# Altium schematic sheet FLEX_MCU_CONFIG.SchDoc
size A2; PageSetup: Record=PageOptions|CenterHorizontal=True|CenterVertical=True|PrintScale=0.69|XCorrection=1.00|YCorrection=1.00|PrintKind=0|BorderSize=5000000|LeftOffset=0|BottomOffset=0|Orientation=2|PaperLength=1000|PaperWidth=1000|Scale=100|PaperSource=7|PrintQuality=-3|MediaType=1|DitherType=10|PrintScaleMode=1|PaperKind=Tabloid|PaperIndex=3
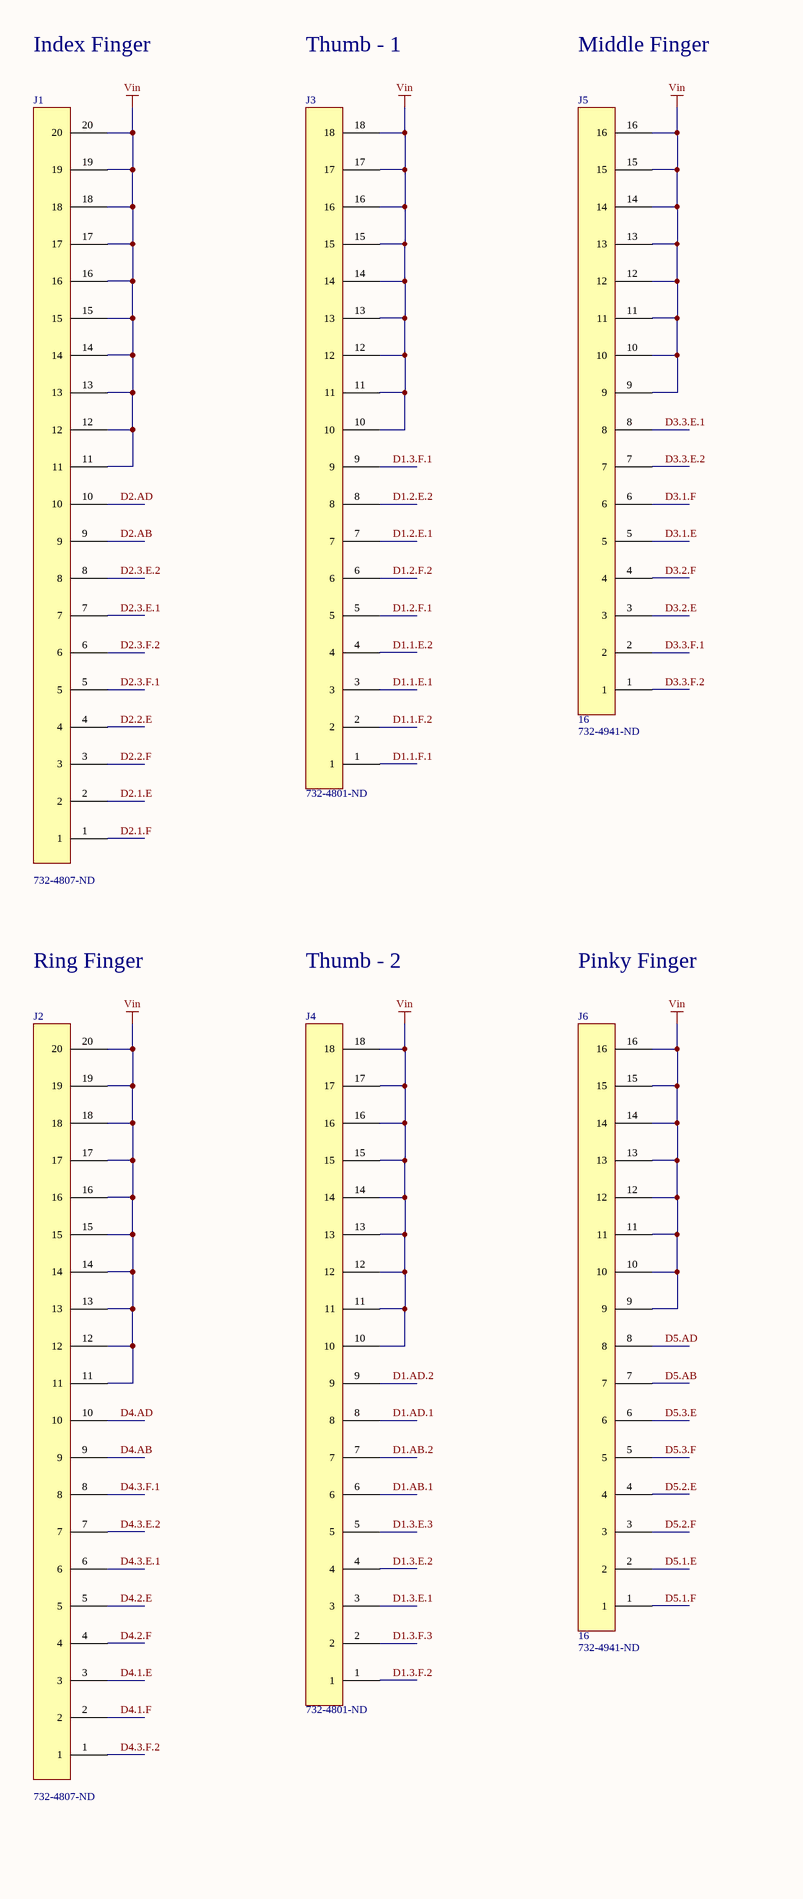
[diagram p0: FLEX_MCU_CONFIG.SchDoc, left]
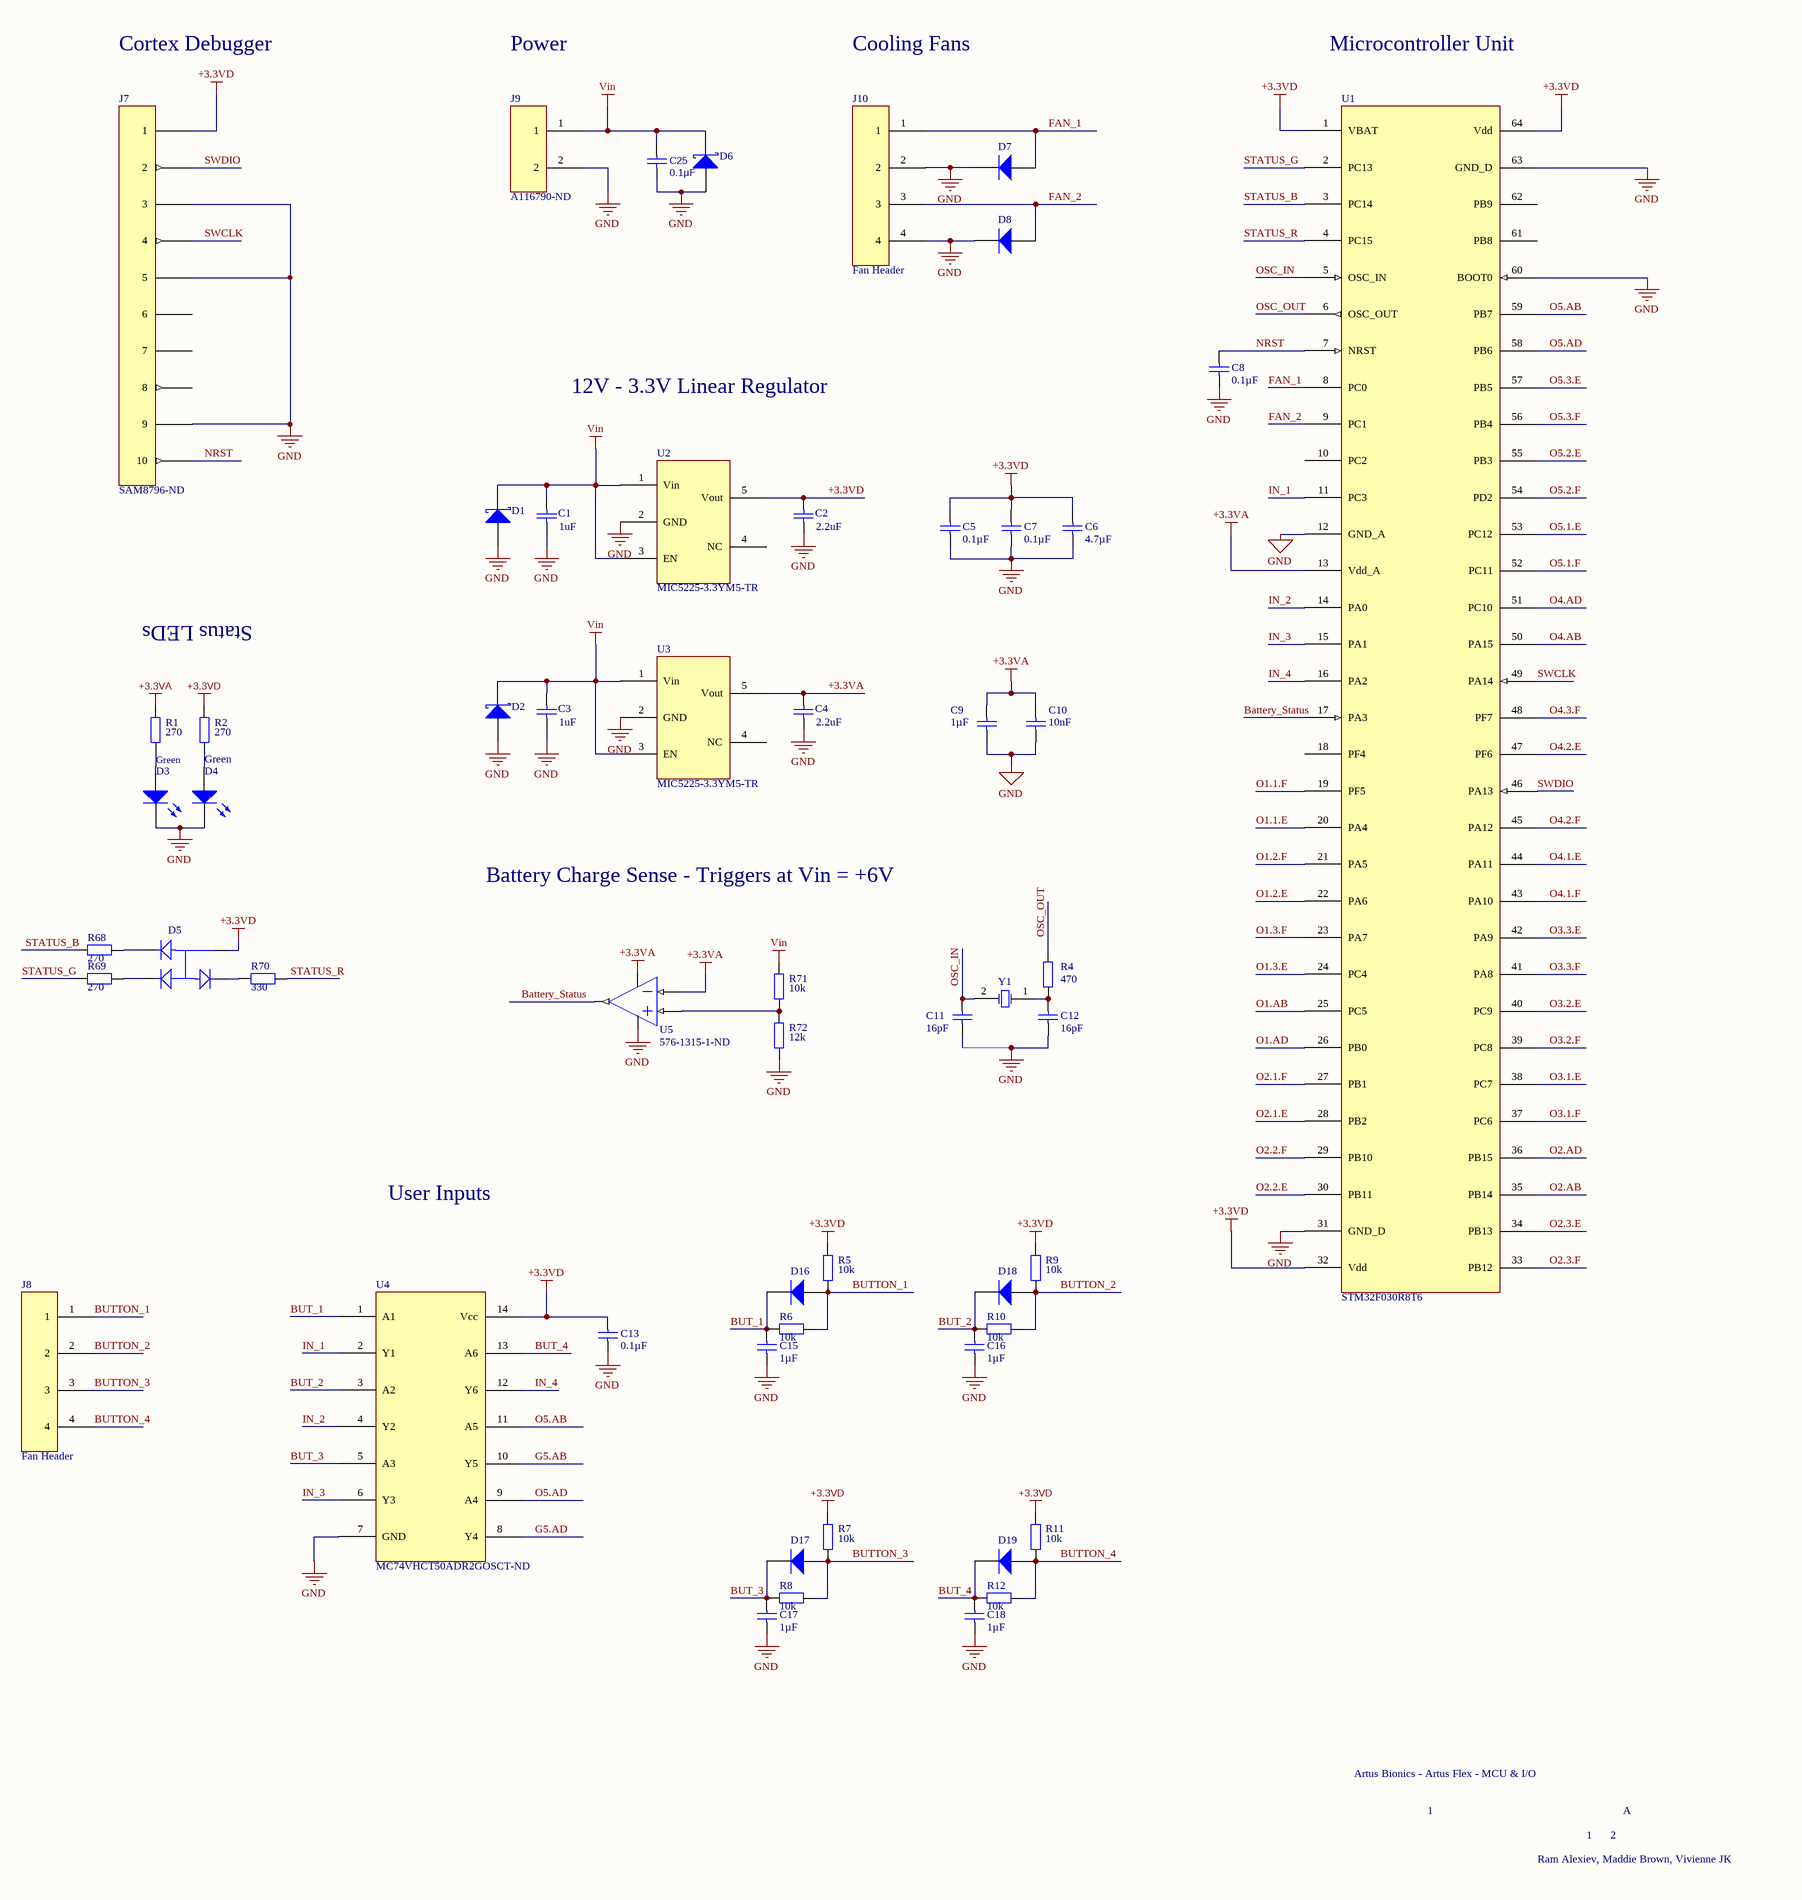
[diagram p1: FLEX_MCU_CONFIG.SchDoc, right]

## Parts
C1  value 1uF  [TDK C-Series (1608)]
C2  value 2.2uF  [TDK C-Series (1608)]
C3  value 1uF  [TDK C-Series (1608)]
C4  value 2.2uF  [TDK C-Series (1608)]
C5  value 0.1µF  [TDK C-Series (1608)]
C6  value 4.7µF  [TDK C-Series (1608)]  (hidden comment: Cap)
C7  value 0.1µF  [TDK C-Series (1608)]
C8  value 0.1µF  [TDK C-Series (1608)]
C9  value 1µF  [TDK C-Series (1608)]
C10  value 10nF  [TDK C-Series (1608)]
C11  value 16pF  [Johanson S-Series (1608)]
C12  value 16pF  [Johanson S-Series (1608)]
C13  value 0.1µF  [TDK C-Series (1608)]  (hidden comment: Cap)
C15  value 1µF  [TDK C-Series (1608)]  (hidden comment: Cap)
C16  value 1µF  [TDK C-Series (1608)]  (hidden comment: Cap)
C17  value 1µF  [TDK C-Series (1608)]  (hidden comment: Cap)
C18  value 1µF  [TDK C-Series (1608)]  (hidden comment: Cap)
C25  value 0.1µF  [TDK C-Series (1608)]
D1  (no value)  [Diode_TVS]
D2  (no value)  [Diode_TVS]
D3  LTST-C193KGKT-5A  [Lite-On LTST-C193K-Series (1608)]  (value not drawn)
D4  LTST-C193KGKT-5A  [Lite-On LTST-C193K-Series (1608)]  (value not drawn)
D5  Cree CLVBA-FKA-CAEDH8BBB7A363  [Cree CLVBA-FKA-Series (4-SOJ)]  (value not drawn)
D6  Diode BAT17  [Diode_TVS]  (value not drawn)
D7  Diode 1N4006  [Diode_Shottky]  (value not drawn)
D8  Diode 1N4006  [Diode_Shottky]  (value not drawn)
D16  de  [Diode_Shottky]  (value not drawn)
D17  de  [Diode_Shottky]  (value not drawn)
D18  de  [Diode_Shottky]  (value not drawn)
D19  de  [Diode_Shottky]  (value not drawn)
J1  Supplier Part Number 1: 732-4807-ND  [20PIN_UP_CONNECTOR]  (hidden comment: 20 Pin Header)
J2  Supplier Part Number 1: 732-4807-ND  [20PIN_UP_CONNECTOR]  (hidden comment: 20 Pin Header)
J3  Supplier Part Number 1: 732-4801-ND  [18PIN_UP_CONNECTOR]  (hidden comment: 18 Pin Header)
J4  Supplier Part Number 1: 732-4801-ND  [18PIN_UP_CONNECTOR]  (hidden comment: 18 Pin Header)
J5  16  Supplier Part Number 1: 732-4941-ND
J6  16  Supplier Part Number 1: 732-4941-ND
J7  Supplier Part Number 2: SAM8796-ND  [Samtec FTSH-105-01-L-DV-K]  (hidden comment: Cortex Debugger)
J8  Fan Header
J9  Supplier Part Number 1: A116790-ND  [2PIN_TERMINAL_BLOCK]  (hidden comment: Power Header)
J10  Fan Header
R1  value 270  [Panasonic ERJ-Series (1608)]
R2  value 270  [Panasonic ERJ-Series (1608)]
R4  value 470  [Panasonic ERJ-Series (1608)]
R5  value 10k  [Panasonic ERJ-Series (1608)]
R6  value 10k  [Panasonic ERJ-Series (1608)]
R7  value 10k  [Panasonic ERJ-Series (1608)]
R8  value 10k  [Panasonic ERJ-Series (1608)]
R9  value 10k  [Panasonic ERJ-Series (1608)]
R10  value 10k  [Panasonic ERJ-Series (1608)]
R11  value 10k  [Panasonic ERJ-Series (1608)]
R12  value 10k  [Panasonic ERJ-Series (1608)]
R68  value 270  [Panasonic ERJ-Series (1608)]
R69  value 270  [Panasonic ERJ-Series (1608)]
R70  value 330  [Panasonic ERJ-Series (1608)]
R71  value 10k  [Panasonic ERJ-Series (1608)]
R72  value 12k  [Panasonic ERJ-Series (1608)]
U1  STM32F030R8T6
U2  MIC5225-3.3YM5-TR  [LINEAR REGULATOR SOT95P280X145-5N]
U3  MIC5225-3.3YM5-TR  [LINEAR REGULATOR SOT95P280X145-5N]
U4  Supplier Part Number 1: MC74VHCT50ADR2GOSCT-ND  (hidden comment: MC74VHCT50A)
U5  Supplier Part Number 1: 576-1315-1-ND  [LINEAR REGULATOR SOT95P280X145-5N]  (hidden comment: TSV991ILT)
Y1  (no value)  [Abracon ABM3-8.000MHZ-D2Y-T (2-DFN)]

## Nets
+3.3VA: C4.2 C9.2 C10.2 R1.2 U1.13(Vdd_A) U3.5(Vout) U5.2(VCC-) U5.4(IN-)
+3.3VD: C2.2 C5.2 C6.2 C7.2 C13.2 D5.2(COMMON_ANODE) J7.1 R2.2 R5.1 R7.1 R9.1 R11.1 U1.1(VBAT) U1.32(Vdd) U1.64(Vdd) U2.5(Vout) U4.14(Vcc)
GND: C1.1 C2.1 C3.1 C4.1 C5.1 C6.1 C7.1 C8.1 C9.1 C10.1 C11.2 C12.2 C13.1 C15.1 C16.1 C17.1 C18.1 C25.1 D1.3(A) D2.3(A) D3.2(K) D4.2(K) D6.1(A) D7.2(K) D8.2(K) J7.3 J7.5 J7.9 J9.2 J10.2 J10.4 R72.2 U1.12(GND_A) U1.31(GND_D) U1.60(BOOT0) U1.63(GND_D) U2.2(GND) U3.2(GND) U4.7(GND) U5.5(VCC+)
Vin: C1.2 C3.2 C25.2 D1.1(K) D2.1(K) D6.3(K) J1.11 J1.12 J1.13 J1.14 J1.15 J1.16 J1.17 J1.18 J1.19 J1.20 J2.11 J2.12 J2.13 J2.14 J2.15 J2.16 J2.17 J2.18 J2.19 J2.20 J3.10 J3.11 J3.12 J3.13 J3.14 J3.15 J3.16 J3.17 J3.18 J4.10 J4.11 J4.12 J4.13 J4.14 J4.15 J4.16 J4.17 J4.18 J5.9 J5.10 J5.11 J5.12 J5.13 J5.14 J5.15 J5.16 J6.9 J6.10 J6.11 J6.12 J6.13 J6.14 J6.15 J6.16 J9.1 R71.1 U2.1(Vin) U2.3(EN) U3.1(Vin) U3.3(EN)
Battery_Status: U1.17(PA3) U5.1(OUT)
BUT_1: C15.2 D16.2(K) R6.1 U4.1(A1)
BUT_2: C16.2 D18.2(K) R10.1 U4.3(A2)
BUT_3: C17.2 D17.2(K) R8.1 U4.5(A3)
BUT_4: C18.2 D19.2(K) R12.1 U4.13(A6)
BUTTON_1: D16.1(A) J8.1 R5.2 R6.2
BUTTON_2: D18.1(A) J8.2 R9.2 R10.2
BUTTON_3: D17.1(A) J8.3 R7.2 R8.2
BUTTON_4: D19.1(A) J8.4 R11.2 R12.2
D1.1.E.1: J3.3
D1.1.E.2: J3.4
D1.1.F.1: J3.1
D1.1.F.2: J3.2
D1.2.E.1: J3.7
D1.2.E.2: J3.8
D1.2.F.1: J3.5
D1.2.F.2: J3.6
D1.3.E.1: J4.3
D1.3.E.2: J4.4
D1.3.E.3: J4.5
D1.3.F.1: J3.9
D1.3.F.2: J4.1
D1.3.F.3: J4.2
D1.AB.1: J4.6
D1.AB.2: J4.7
D1.AD.1: J4.8
D1.AD.2: J4.9
D2.1.E: J1.2
D2.1.F: J1.1
D2.2.E: J1.4
D2.2.F: J1.3
D2.3.E.1: J1.7
D2.3.E.2: J1.8
D2.3.F.1: J1.5
D2.3.F.2: J1.6
D2.AB: J1.9
D2.AD: J1.10
D3.1.E: J5.5
D3.1.F: J5.6
D3.2.E: J5.3
D3.2.F: J5.4
D3.3.E.1: J5.8
D3.3.E.2: J5.7
D3.3.F.1: J5.2
D3.3.F.2: J5.1
D4.1.E: J2.3
D4.1.F: J2.2
D4.2.E: J2.5
D4.2.F: J2.4
D4.3.E.1: J2.6
D4.3.E.2: J2.7
D4.3.F.1: J2.8
D4.3.F.2: J2.1
D4.AB: J2.9
D4.AD: J2.10
D5.1.E: J6.2
D5.1.F: J6.1
D5.2.E: J6.4
D5.2.F: J6.3
D5.3.E: J6.6
D5.3.F: J6.5
D5.AB: J6.7
D5.AD: J6.8
FAN_1: D7.1(A) J10.1 U1.8(PC0)
FAN_2: D8.1(A) J10.3 U1.9(PC1)
G5.AB: U4.10(Y5)
G5.AD: U4.8(Y4)
IN_1: U1.11(PC3) U4.2(Y1)
IN_2: U1.14(PA0) U4.4(Y2)
IN_3: U1.15(PA1) U4.6(Y3)
IN_4: U1.16(PA2) U4.12(Y6)
NRST: C8.2 J7.10 U1.7(NRST)
O1.1.E: U1.20(PA4)
O1.1.F: U1.19(PF5)
O1.2.E: U1.22(PA6)
O1.2.F: U1.21(PA5)
O1.3.E: U1.24(PC4)
O1.3.F: U1.23(PA7)
O1.AB: U1.25(PC5)
O1.AD: U1.26(PB0)
O2.1.E: U1.28(PB2)
O2.1.F: U1.27(PB1)
O2.2.E: U1.30(PB11)
O2.2.F: U1.29(PB10)
O2.3.E: U1.34(PB13)
O2.3.F: U1.33(PB12)
O2.AB: U1.35(PB14)
O2.AD: U1.36(PB15)
O3.1.E: U1.38(PC7)
O3.1.F: U1.37(PC6)
O3.2.E: U1.40(PC9)
O3.2.F: U1.39(PC8)
O3.3.E: U1.42(PA9)
O3.3.F: U1.41(PA8)
O4.1.E: U1.44(PA11)
O4.1.F: U1.43(PA10)
O4.2.E: U1.47(PF6)
O4.2.F: U1.45(PA12)
O4.3.F: U1.48(PF7)
O4.AB: U1.50(PA15)
O4.AD: U1.51(PC10)
O5.1.E: U1.53(PC12)
O5.1.F: U1.52(PC11)
O5.2.E: U1.55(PB3)
O5.2.F: U1.54(PD2)
O5.3.E: U1.57(PB5)
O5.3.F: U1.56(PB4)
O5.AB: U1.59(PB7) U4.11(A5)
O5.AD: U1.58(PB6) U4.9(A4)
OSC_IN: C11.1 U1.5(OSC_IN) Y1.2(OSC2)
OSC_OUT: R4.2 U1.6(OSC_OUT)
STATUS_B: R68.1 U1.3(PC14)
STATUS_G: R69.1 U1.2(PC13)
STATUS_R: R70.2 U1.4(PC15)
SWCLK: J7.4 U1.49(PA14)
SWDIO: J7.66(2) U1.46(PA13)
NetC12_1: C12.1 R4.1 Y1.1(OSC1)
NetD3_1: D3.1(A) R1.1
NetD4_1: D4.1(A) R2.1
NetD5_1: D5.1(RED) R70.1
NetD5_3: D5.3(BLUE) R68.2
NetD5_4: D5.4(GREEN) R69.2
NetR71_2: R71.2 R72.1 U5.3(IN+)

Not connected (* = marked no-connect by the designer): J7 6 7 8; U1 10(PC2) 18(PF4) 61(PB8) 62(PB9); U2 4(NC); U3 4(NC)

## Notes on the sheet
- Index Finger
- Thumb - 1
- Middle Finger
- Cortex Debugger
- Power
- Cooling Fans
- Microcontroller Unit
- 12V - 3.3V Linear Regulator
- Status LEDs
- (near R1) Green
- (near R2) Green
- Battery Charge Sense - Triggers at Vin = +6V
- Ring Finger
- Thumb - 2
- Pinky Finger
- User Inputs
- Artus Bionics - Artus Flex - MCU & I/O
- 1
- 2
- A
- Ram Alexiev, Maddie Brown, Vivienne JK

## Library data of the parts
C1-C13 C15-C18 C25 = Cap: Capacitor; Published: 8-Jun-2000; LatestRevisionDate: 17-Jul-2002; LatestRevisionNote: Re-released for DXP Platform.; PackageReference: RAD-0.3; Publisher: Altium Limited; PackageDescription: Radial Cap, Thru-Hole; 2 Leads; 0.3 in Pin Spacing; Supplier 1: Digi-Key
  C1 C3: Supplier 2: Digi-Key; Supplier Part Number 2: 445-5146-1-ND
  C2 C4: Supplier 2: Digi-Key; Supplier Part Number 2: 445-5964-1-ND
  C5 C7 C8 C13 C25: Supplier Part Number 1: 445-1316-1-ND
  C6: Supplier Part Number 1: 445-7482-1-ND
  C9: Supplier Part Number 1: 445-5956-1-ND
  C10: Supplier Part Number 1: 445-1304-1-ND
  C11 C12: Supplier Part Number 1: 712-1320-1-ND
  C15-C18: Supplier Part Number 1: 445-5146-1-ND
D1 D2 = Diode 10TQ035: Schottky Rectifier; Note: Terminal 2 is the TAB and is electrically connected to the cathode; Published: 8-Jun-2000; LatestRevisionDate: 17-Jul-2002; LatestRevisionNote: Re-released for DXP Platform.; DatasheetVersion: PD-2.057B; PackageVersion: Feb-1998; PackageReference: TO-220AC; Publisher: Altium Limited; PackageDescription: TO, Thru-Hole, Vertical, Heatsink Mounted; 3 In-Line Leads (1 Absent); Pitch 2.54 mm; ComponentLink1Description: Manufacturer Link; ComponentLink1URL: http://www.irf.com/; ComponentLink2Description: Datasheet; ComponentLink2URL: http://www.irf.com/product-info/datasheets/data/10tq.pdf; Supplier 1: Digi-Key; Supplier 2: Digi-Key; Supplier Part Number 2: SMBJ8.0D-M3/HGICT-ND
D3 D4 = LED0: Typical INFRARED GaAs LED; Published: 8-Jun-2000; LatestRevisionDate: 08-Jul-2005; LatestRevisionNote: Mech Layer 1 removed.; PackageReference: LED-0; Publisher: Altium Limited; PackageDescription: LED; 2 Leads; Supplier 1: Digi-Key; Supplier Part Number 1: 160-1828-1-ND
D5 = Cree CLVBA-FKA-CAEDH8BBB7A363: RGB LED; Supplier 1: Digi-Key; Supplier Part Number 1: CLVBA-FKA-CAEDH8BBB7A363CT-ND
D6 = Diode BAT17: Silicon RF Schottky Diode for Mixer Applications in the VHF/UHF Range; Note: Pin 2 is not connected and not drawn.; Published: 21-Mar-2003; LatestRevisionDate: 29-May-2009; LatestRevisionNote: IPC-7351 Footprint Added.; DatasheetVersion: Oct-1999; PackageVersion: Sep-2001; PackageReference: SOT-23; Publisher: Altium Limited; PackageDescription: 3-Pin SOT-23 Package 0.95 mm Pitch, 2.5 mm Lead Span; ComponentLink1Description: Manufacturer Link; ComponentLink1URL: http://www.infineon.com/; ComponentLink2Description: Datasheet; ComponentLink2URL: http://www.infineon.com/upload/Document/cmc_upload/documents/009/363/bat17series.pdf; Supplier 1: Digi-Key; Supplier Part Number 1: DF2S10FSL3MCT-ND
D7 D8 = Diode 1N4006: 1 Amp General Purpose Rectifier; Published: 8-Jun-2000; LatestRevisionDate: 17-Jul-2002; LatestRevisionNote: Re-released for DXP Platform.; DatasheetVersion: 1998; PackageVersion: Aug-1999; PackageReference: DO-41; Publisher: Altium Limited; PackageDescription: Diode, Axial; Body 5.2 x 2.7 mm (LxDia. max), Lead Dia. 0.86 mm (max); Code_JEDEC: DO-204-AL; ComponentLink1Description: Manufacturer Link; ComponentLink1URL: http://www.fairchildsemi.com/; ComponentLink2Description: Datasheet; ComponentLink2URL: http://www.fairchildsemi.com/ds/1N%2F1N4001.pdf; Supplier 1: Digi-Key; Supplier Part Number 1: 1655-1502-1-ND
D16-D19 = Diode: Default Diode; Published: 8-Jun-2000; LatestRevisionDate: 17-Jul-2002; LatestRevisionNote: Re-released for DXP Platform.; PackageVersion: Sep-1996; PackageReference: SMC; Publisher: Altium Limited; PackageDescription: DO-214-AB/SMC; 2 C-Bend Leads; Body 7.9 x 5.9 mm, inc. leads (LxW); Code_JEDEC: DO-214-AB; Supplier 1: Digi-Key; Supplier Part Number 1: 1727-5384-1-ND
J1 J2 = 20 Pin Header: 20 position header; Supplier 1: Digi-Key
J3 J4 = 18 Pin Header: 18 Position Header; Supplier 1: Digi-Key
J5 J6 = 16: 16 Position header; Supplier 1: Digi-Key
J7 = Cortex Debugger: Header; Supplier 1: Digi-Key; Supplier 2: Digi-Key
R1 R2 R4-R12 R68-R72 = Res2: Resistor; Published: 8-Jun-2000; LatestRevisionDate: 17-Jul-2002; LatestRevisionNote: Re-released for DXP Platform.; PackageReference: AXIAL-0.4; Publisher: Altium Limited; PackageDescription: Axial Device, Thru-Hole; 2 Leads; 0.4 in Pin Spacing; Supplier 1: Digi-Key
  R1 R2 R68 R69: Supplier Part Number 1: P270HCT-ND
  R4: Supplier Part Number 1: P470HCT-ND
  R5-R12 R71: Supplier Part Number 1: P10.0KHCT-ND
  R70: Supplier Part Number 1: P330HCT-ND
  R72: Supplier Part Number 1: P12.0KHCT-ND
U1 = STM32F030R8T6: MCU; Supplier Part Number 1: 497-14045-ND; Supplier 1: Digi-Key
U2 U3 = MIC5225-3.3YM5-TR: 12V-3.3V Linear Regulator; Supplier 1: Digi-Key; Supplier Part Number 1: 576-2980-1-ND
U4 = MC74VHCT50A: 6-Channel CMOS Buffer; Supplier 1: Digi-Key
U5 = STMicroelectronics TSV991ILT: 20MHz Op-Amp; Supplier 1: Digi-Key
Y1 = XTAL: Crystal Oscillator; Published: 8-Jun-2000; LatestRevisionDate: 17-Jul-2002; LatestRevisionNote: Re-released for DXP Platform.; PackageReference: R38; Publisher: Altium Limited; PackageDescription: Crystal, Thru-Hole; 2 Leads; Body 3.1 x 8.2 mm (Dia.xH); Supplier 1: Digi-Key; Supplier Part Number 1: 535-10630-1-ND
J8 J10 = Fan Header: Supplier 1: Digi-Key; Supplier Part Number 1: A33201CT-ND
J9 = Power Header: Supplier 1: Digi-Key